# Altium project DIOT_temperature_logger.PrjPCB (part 3 of 6)

## Sheet EEM_DIOT_connector.SchDoc: Stabilizer
size 420 x 297 mm; Author: G.Kasprowicz; CompanyName: WUT ISE; DrawnBy: G.Kasprowicz; Organization: WUT ISE; Address1: PW ISE; Address2: Nowowiejska 15/19 00-665 Warsaw; Address3: gkasprow@gmail.com; DocumentNumber: 6; Revision: 1.0; SheetNumber: 6; SheetTotal: 8; ModifiedBy: -; CheckedDate: -; Title2: EEM connector & drivers; DivGrp: WUT ISE; Designer: G.Kasprowicz; ModifiedDate: -; ProjectName: Sensor Box
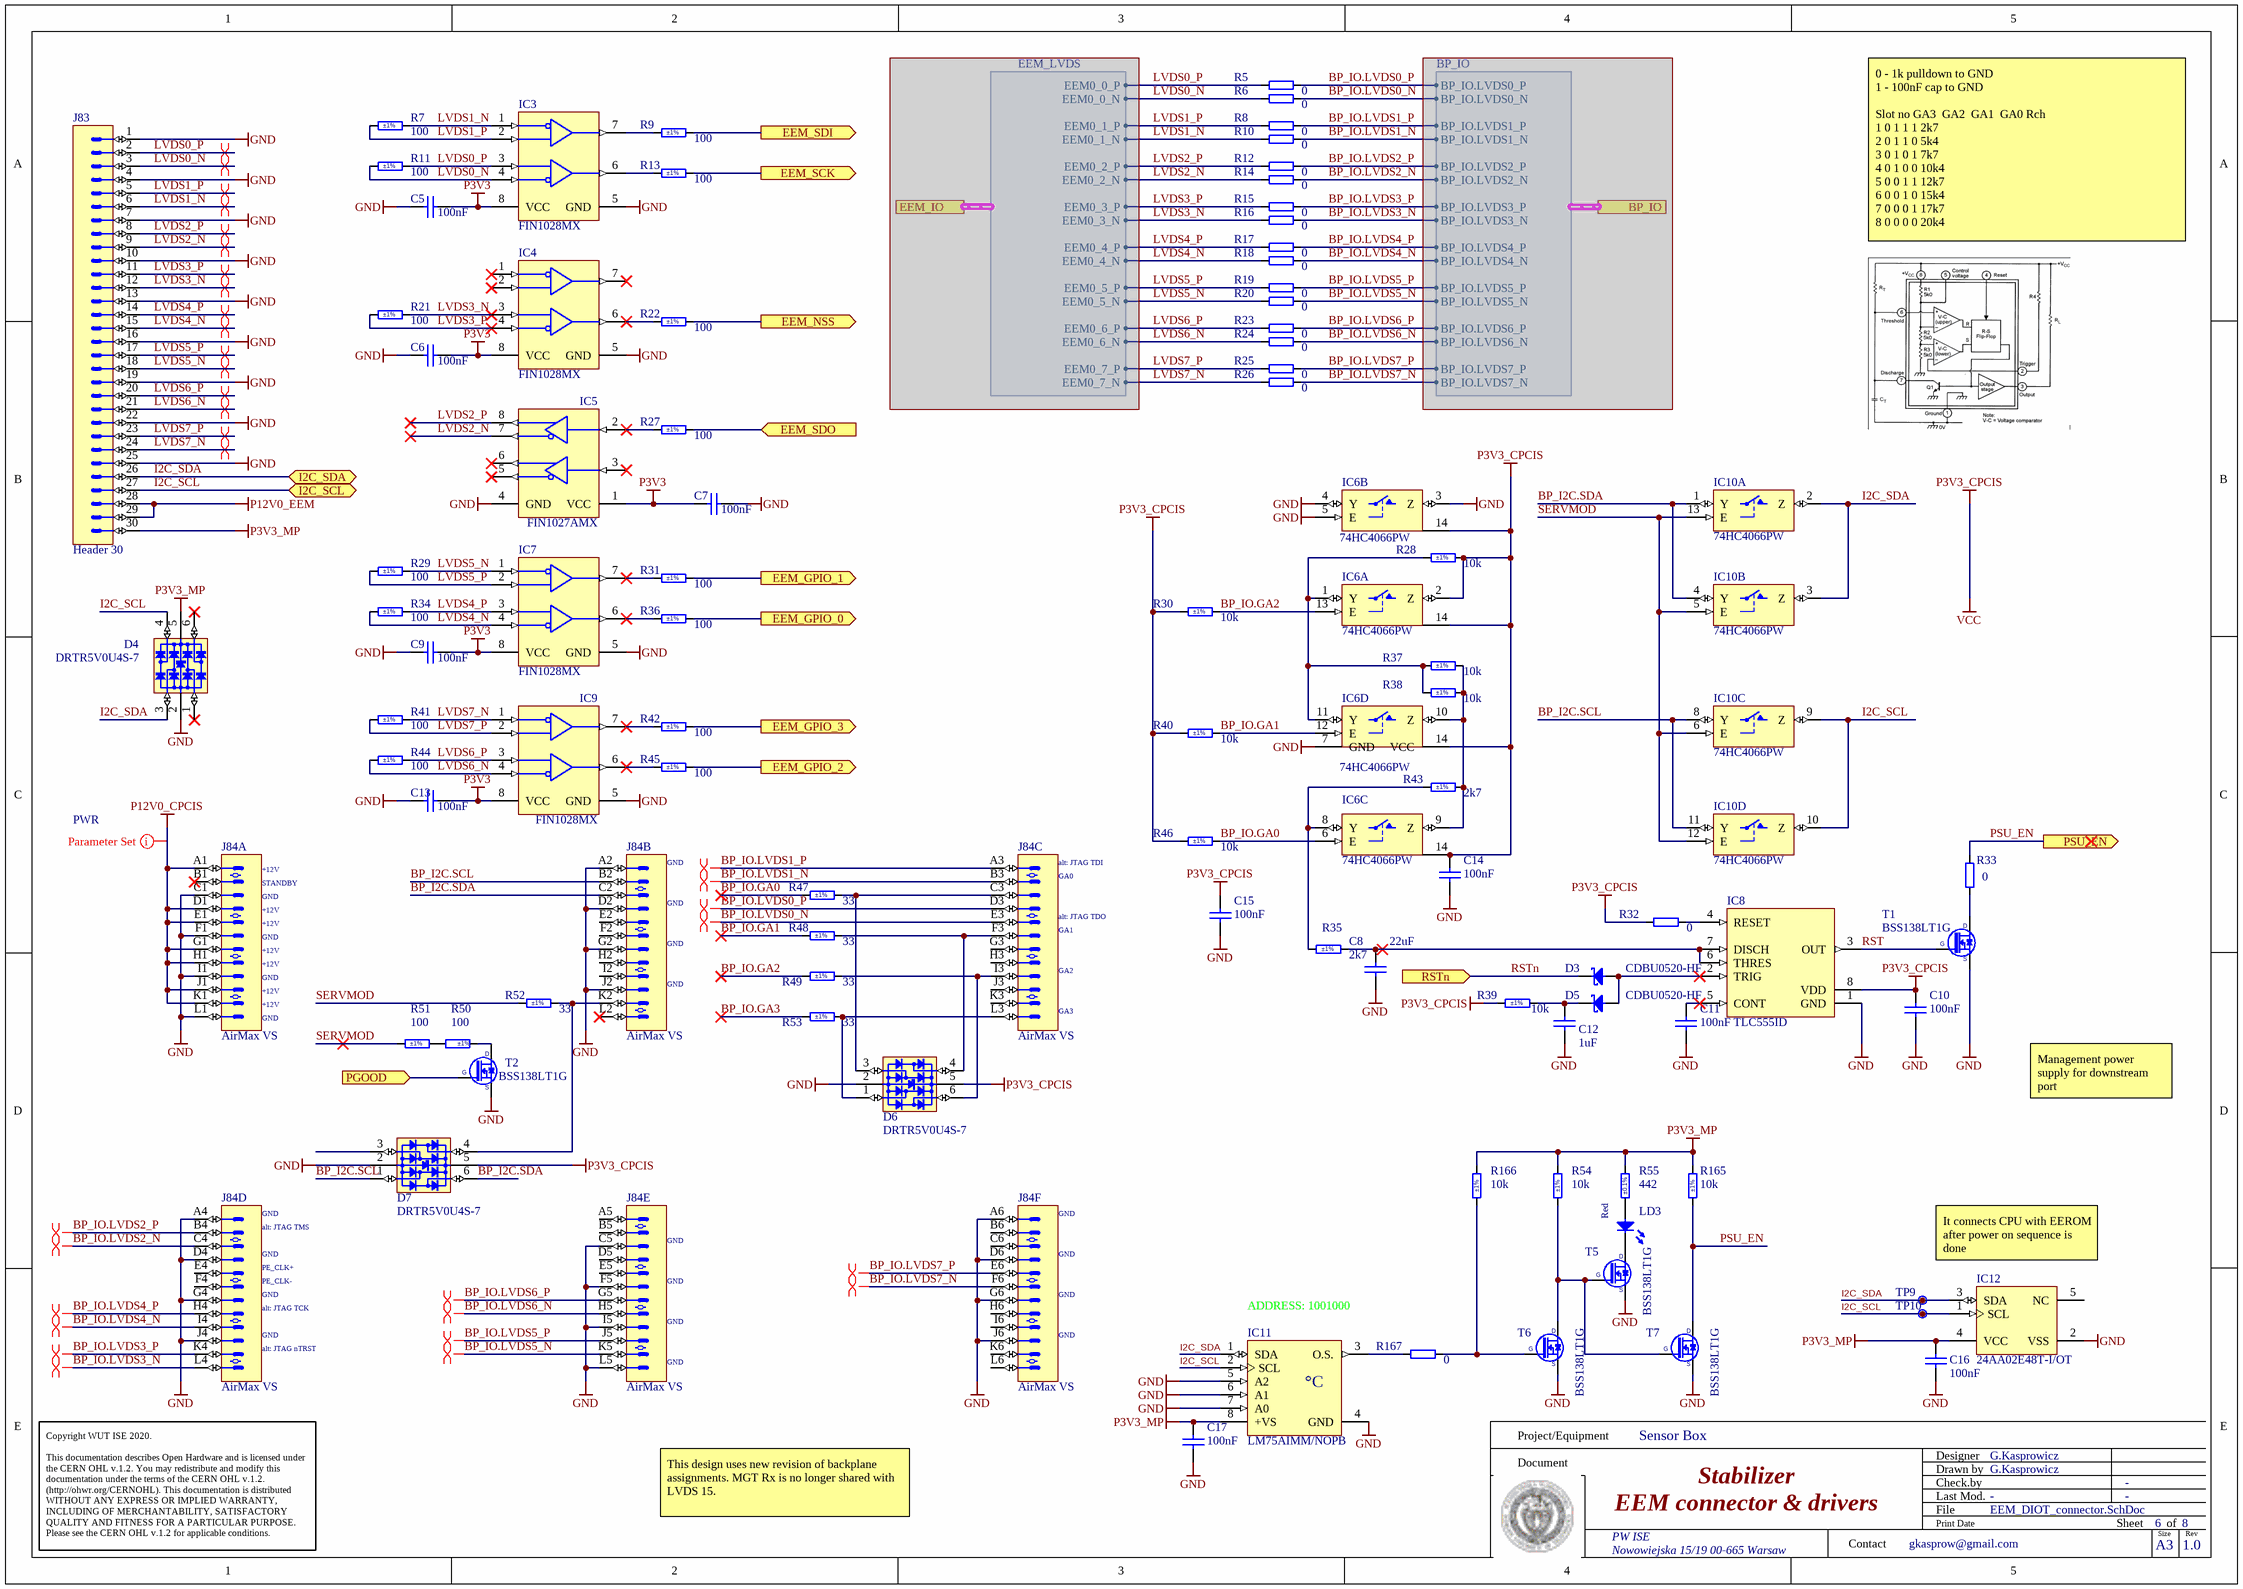
[diagram p3: EEM_DIOT_connector.SchDoc]

### Parts
C5  100nF  [CAPC1608X87N]
C6  100nF  [CAPC1608X87N]
C7  100nF  [CAPC1608X87N]
C8  22uF  [CAPC2012X135N]
C9  100nF  [CAPC1608X87N]
C10  100nF  [CAPC1608X87N]
C11  100nF  [CAPC1608X87N]
C12  1uF  [CAPC1608X87N]
C13  100nF  [CAPC1608X87N]
C14  100nF  [CAPC1608X87N]
C15  100nF  [CAPC1608X87N]
C16  100nF  [CAPC1608X87N]
C17  100nF  [CAPC1608X87N]
D3  CDBU0520-HF  [SOD-523F]
D4  DRTR5V0U4S-7  [SOT65P210X110-6N]
D5  CDBU0520-HF  [SOD-523F]
D6  DRTR5V0U4S-7  [SOT65P210X110-6N]
D7  DRTR5V0U4S-7  [SOT65P210X110-6N]
IC3  FIN1028MX  [SOIC127P600X175-8N]
IC4  FIN1028MX  [SOIC127P600X175-8N]
IC5  FIN1027AMX  [SOIC127P600X175-8N]
IC6  74HC4066PW  [SOP65P640X110-14N]  (parts A,B,C,D of 4)
IC7  FIN1028MX  [SOIC127P600X175-8N]
IC8  TLC555ID  [SOIC127P600X175-8N]
IC9  FIN1028MX  [SOIC127P600X175-8N]
IC10  74HC4066PW  [SOP65P640X110-14N]  (parts A,B,C,D of 4)
IC11  LM75AIMM/NOPB  [SOP65P490X109-8N]
IC12  24AA02E48T-I/OT  [SOT95P280X145-5N]
J83  Header 30  [3M_N2530-6002RB]
J84  AirMax VS  [AMPHENOL_10052825-101LF]  (parts A,B,C,D,E,F of 6)
LD3  Red  [LED_KINGBRIGHT_KPH-1608SURCK]
R5  0  [RESC1608X55N]
R6  0  [RESC1608X55N]
R7  100  Tolerance: ±1%  [RESC1608X55N]
R8  0  [RESC1608X55N]
R9  100  Tolerance: ±1%  [RESC1608X55N]
R10  0  [RESC1608X55N]
R11  100  Tolerance: ±1%  [RESC1608X55N]
R12  0  [RESC1608X55N]
R13  100  Tolerance: ±1%  [RESC1608X55N]
R14  0  [RESC1608X55N]
R15  0  [RESC1608X55N]
R16  0  [RESC1608X55N]
R17  0  [RESC1608X55N]
R18  0  [RESC1608X55N]
R19  0  [RESC1608X55N]
R20  0  [RESC1608X55N]
R21  100  Tolerance: ±1%  [RESC1608X55N]
R22  100  Tolerance: ±1%  [RESC1608X55N]
R23  0  [RESC1608X55N]
R24  0  [RESC1608X55N]
R25  0  [RESC1608X55N]
R26  0  [RESC1608X55N]
R27  100  Tolerance: ±1%  [RESC1608X55N]
R28  10k  Tolerance: ±1%  [RESC1608X55N]
R29  100  Tolerance: ±1%  [RESC1608X55N]
R30  10k  Tolerance: ±1%  [RESC1608X55N]
R31  100  Tolerance: ±1%  [RESC1608X55N]
R32  0  [RESC1608X55N]
R33  0  [RESC1608X55N]
R34  100  Tolerance: ±1%  [RESC1608X55N]
R35  2k7  Tolerance: ±1%  [RESC1608X55N]
R36  100  Tolerance: ±1%  [RESC1608X55N]
R37  10k  Tolerance: ±1%  [RESC1608X55N]
R38  10k  Tolerance: ±1%  [RESC1608X55N]
R39  10k  Tolerance: ±1%  [RESC1608X55N]
R40  10k  Tolerance: ±1%  [RESC1608X55N]
R41  100  Tolerance: ±1%  [RESC1608X55N]
R42  100  Tolerance: ±1%  [RESC1608X55N]
R43  2k7  Tolerance: ±1%  [RESC1608X55N]
R44  100  Tolerance: ±1%  [RESC1608X55N]
R45  100  Tolerance: ±1%  [RESC1608X55N]
R46  10k  Tolerance: ±1%  [RESC1608X55N]
R47  33  Tolerance: ±1%  [RESC1608X55N]
R48  33  Tolerance: ±1%  [RESC1608X55N]
R49  33  Tolerance: ±1%  [RESC1608X55N]
R50  100  Tolerance: ±1%  [RESC1608X55N]
R51  100  Tolerance: ±1%  [RESC1608X55N]
R52  33  Tolerance: ±1%  [RESC1608X55N]
R53  33  Tolerance: ±1%  [RESC1608X55N]
R54  10k  Tolerance: ±1%  [RESC1608X55N]
R55  442  Tolerance: ±0.1%  [RESC1608X55N]
R165  10k  Tolerance: ±1%  [RESC1608X55N]
R166  10k  Tolerance: ±1%  [RESC1608X55N]
R167  0  [RESC1608X55N]
T1  BSS138LT1G  [SOT95P240X110-3N]
T2  BSS138LT1G  [SOT95P240X110-3N]
T5  BSS138LT1G  [SOT95P240X110-3N]
T6  BSS138LT1G  [SOT95P240X110-3N]
T7  BSS138LT1G  [SOT95P240X110-3N]
TP9  Test Point  [TPS127]  (value not drawn)  (net tie, no BOM)
TP10  Test Point  [TPS127]  (value not drawn)  (no BOM)

### Ports
BP_IO (harness BP_IO), EEM_GPIO_0 (out), EEM_GPIO_1 (out), EEM_GPIO_2 (out), EEM_GPIO_3 (out), EEM_IO (harness EEM_LVDS), EEM_NSS (out), EEM_SCK (out), EEM_SDI (out), EEM_SDO (in), I2C_SCL (bidir), I2C_SDA (bidir), PGOOD (in), PSU_EN (out), RSTn (in)

### Harnesses
EEM_LVDS: EEM0_0_P, EEM0_0_N, EEM0_1_P, EEM0_1_N, EEM0_2_P, EEM0_2_N, EEM0_3_P, EEM0_3_N, EEM0_4_P, EEM0_4_N, EEM0_5_P, EEM0_5_N, EEM0_6_P, EEM0_6_N, EEM0_7_P, EEM0_7_N
BP_IO: BP_IO.LVDS0_P, BP_IO.LVDS0_N, BP_IO.LVDS1_P, BP_IO.LVDS1_N, BP_IO.LVDS2_P, BP_IO.LVDS2_N, BP_IO.LVDS3_P, BP_IO.LVDS3_N, BP_IO.LVDS4_P, BP_IO.LVDS4_N, BP_IO.LVDS5_P, BP_IO.LVDS5_N, BP_IO.LVDS6_P, BP_IO.LVDS6_N, BP_IO.LVDS7_P, BP_IO.LVDS7_N

### Nets
GND: C5.2 C6.2 C7.1 C8.1 C9.2 C10.1 C11.1 C12.1 C13.2 C14.1 C15.1 C16.1 C17.1 D4.2(GND) D6.2(GND) D7.2(GND) IC3.5(GND) IC4.5(GND) IC5.4(GND) IC6.3(Z) IC6.4(Y) IC6.5(E) IC6.7(GND) IC7.5(GND) IC8.1(GND) IC9.5(GND) IC10.7(GND) IC11.4(GND) IC11.5(A2) IC11.6(A1) IC11.7(A0) IC12.2(VSS) J83.1 J83.4 J83.7 J83.10 J83.13 J83.16 J83.19 J83.22 J83.25 J84.A2 J84.A4 J84.A6 J84.C1 J84.C5 J84.D2 J84.D4 J84.D6 J84.F1 J84.F5 J84.G2 J84.G4 J84.G6 J84.I1 J84.I5 J84.J2 J84.J4 J84.J6 J84.L1 J84.L5 T1.2(S) T2.2(S) T5.2(S) T6.2(S) T7.2(S)
P3V3: C5.1 C6.1 C7.2 C9.1 C13.1 IC3.8(VCC) IC4.8(VCC) IC5.1(VCC) IC7.8(VCC) IC9.8(VCC)
P3V3_CPCIS: C10.2 C14.2 C15.2 D6.5(VBUS) D7.5(VBUS) IC6.2(Z) IC6.14(VCC) IC8.8(VDD) IC10.14(VCC) R28.2 R30.1 R32.1 R39.1 R40.1 R46.1  [also labelled VCC]
P3V3_MP: C16.2 C17.2 D4.5(VBUS) IC11.8(+VS) IC12.4(VCC) J83.30 R54.1 R55.2 R165.1 R166.1
P12V0_CPCIS: J84.A1 J84.D1 J84.E1 J84.G1 J84.H1 J84.J1 J84.K1
P12V0_EEM: J83.28 J83.29
BP_I2C.SCL: D7.1(I/O1) IC10.8(Y) IC10.11(Y) J84.B2
BP_I2C.SDA: D7.6(I/O4) IC10.1(Y) IC10.4(Y) J84.C2
BP_IO.GA0: IC6.6(E) R46.2 R47.2
BP_IO.GA1: IC6.12(E) R40.2 R48.2
BP_IO.GA2: IC6.13(E) R30.2 R49.2
BP_IO.GA3: R53.2
BP_IO.LVDS0_N: J84.E3 R6.1
BP_IO.LVDS0_P: J84.D3 R5.1
BP_IO.LVDS1_N: J84.B3 R10.1
BP_IO.LVDS1_P: J84.A3 R8.1
BP_IO.LVDS2_N: J84.C4 R14.1
BP_IO.LVDS2_P: J84.B4 R12.1
BP_IO.LVDS3_N: J84.L4 R16.1
BP_IO.LVDS3_P: J84.K4 R15.1
BP_IO.LVDS4_N: J84.I4 R18.1
BP_IO.LVDS4_P: J84.H4 R17.1
BP_IO.LVDS5_N: J84.K5 R20.1
BP_IO.LVDS5_P: J84.J5 R19.1
BP_IO.LVDS6_N: J84.H5 R24.1
BP_IO.LVDS6_P: J84.G5 R23.1
BP_IO.LVDS7_N: J84.F6 R26.1
BP_IO.LVDS7_P: J84.E6 R25.1
CSN: R22.1 ; port EEM_NSS
EEM_GPIO_0: R36.1 ; port EEM_GPIO_0
EEM_GPIO_1: R31.1 ; port EEM_GPIO_1
EEM_GPIO_2: R45.1 ; port EEM_GPIO_2
EEM_GPIO_3: R42.1 ; port EEM_GPIO_3
EEM_SCK: R13.1 ; port EEM_SCK
EEM_SDI: R9.1 ; port EEM_SDI
EEM_SDO: R27.1 ; port EEM_SDO
I2C_SCL: D4.4(I/O3) IC10.9(Z) IC10.10(Z) IC11.2(SCL) IC12.1(SCL) J83.27 TP10.1 ; port I2C_SCL
I2C_SDA: D4.3(I/O2) IC10.2(Z) IC10.3(Z) IC11.1(SDA) IC12.3(SDA) J83.26 TP9.1 ; port I2C_SDA
LVDS0_N: IC3.4(RIN2-) J83.3 R6.2 R11.2
LVDS0_P: IC3.3(RIN2+) J83.2 R5.2 R11.1
LVDS1_N: IC3.1(RIN1-) J83.6 R7.1 R10.2
LVDS1_P: IC3.2(RIN1+) J83.5 R7.2 R8.2
LVDS2_N: IC5.7(DOUT-) J83.9 R14.2
LVDS2_P: IC5.8(DOUT+) J83.8 R12.2
LVDS3_N: IC4.3(RIN2+) J83.12 R16.2 R21.1
LVDS3_P: IC4.4(RIN2-) J83.11 R15.2 R21.2
LVDS4_N: IC7.4(RIN2-) J83.15 R18.2 R34.2
LVDS4_P: IC7.3(RIN2+) J83.14 R17.2 R34.1
LVDS5_N: IC7.1(RIN1-) J83.18 R20.2 R29.1
LVDS5_P: IC7.2(RIN1+) J83.17 R19.2 R29.2
LVDS6_N: IC9.4(RIN2-) J83.21 R24.2 R44.2
LVDS6_P: IC9.3(RIN2+) J83.20 R23.2 R44.1
LVDS7_N: IC9.1(RIN1-) J83.24 R26.2 R41.1
LVDS7_P: IC9.2(RIN1+) J83.23 R25.2 R41.2
PGOOD: T2.1(G) ; port PGOOD
PSU_EN: R33.2 R165.2 T7.3(D) ; port PSU_EN
RST: IC8.3(OUT) T1.1(G)
RSTn: D3.1(C) ; port RSTn
SERVMOD: IC10.5(E) IC10.6(E) IC10.12(E) IC10.13(E) R51.2 R52.2
NetC8_2: C8.2 IC8.6(THRES) IC8.7(DISCH) R35.2
NetC11_2: C11.2 IC8.5(CONT)
NetC12_2: C12.2 D5.1(C) R39.2
NetD3_2: D3.2(A) D5.2(A) IC8.2(TRIG)
NetD6_1: D6.1(I/O1) J84.L3 R53.1
NetD6_3: D6.3(I/O2) J84.C3 R47.1
NetD6_4: D6.4(I/O3) J84.F3 R48.1
NetD6_6: D6.6(I/O4) J84.I3 R49.1
NetD7_4: D7.4(I/O3) J84.K2 R52.1
NetIC3_6: IC3.6(ROUT2) R13.2
NetIC3_7: IC3.7(ROUT1) R9.2
NetIC4_6: IC4.6(ROUT2) R22.2
NetIC5_2: IC5.2(DIN1) R27.2
NetIC6_1: IC6.1(Y) IC6.11(Y) R28.1 R37.1 R38.1
NetIC6_8: IC6.8(Y) R35.1 R43.1
NetIC6_9: IC6.9(Z) IC6.10(Z) R37.2 R38.2 R43.2
NetIC7_6: IC7.6(ROUT2) R36.2
NetIC7_7: IC7.7(ROUT1) R31.2
NetIC8_4: IC8.4(RESET) R32.2
NetIC9_6: IC9.6(ROUT2) R45.2
NetIC9_7: IC9.7(ROUT1) R42.2
NetIC11_3: IC11.3(O.S.) R167.1
NetLD3_1: LD3.1(C) T5.3(D)
NetLD3_2: LD3.2(A) R55.1
NetR33_1: R33.1 T1.3(D)
NetR50_1: R50.1 T2.3(D)
NetR50_2: R50.2 R51.1
NetR54_2: R54.2 T5.1(G) T6.3(D) T7.1(G)
NetR166_2: R166.2 R167.2 T6.1(G)

Not connected (* = marked no-connect by the designer): D4 1(I/O1)* 6(I/O4)*; D7 3(I/O2); IC4 1(RIN1-)* 2(RIN1+)* 7(ROUT1)*; IC5 3(DIN2RIN-)* 5(DOUT-)* 6(DOUT+)*; IC12 5(NC); J84 A5 B1* B5 B6 C6 D5 E2 E4 E5 F2 F4 G3 H2 H3 H6 I2 I6 J3 K3 K6 L2* L6

### Layout directives
differential pair: BP_IO.LVDS0_N, BP_IO.LVDS0_P, BP_IO.LVDS1_N, BP_IO.LVDS1_P, BP_IO.LVDS2_N, BP_IO.LVDS2_P, BP_IO.LVDS3_N, BP_IO.LVDS3_P, BP_IO.LVDS4_N, BP_IO.LVDS4_P, BP_IO.LVDS5_N, BP_IO.LVDS5_P, BP_IO.LVDS6_N, BP_IO.LVDS6_P, BP_IO.LVDS7_N, BP_IO.LVDS7_P, LVDS0_N, LVDS0_P, LVDS1_N, LVDS1_P, LVDS2_N, LVDS2_P, LVDS3_N, LVDS3_P, LVDS4_N, LVDS4_P, LVDS5_N, LVDS5_P, LVDS6_N, LVDS6_P, LVDS7_N, LVDS7_P
net class PWR: P12V0_CPCIS

### Notes on the sheet
- 0 - 1k pulldown to GND
  1 - 100nF cap to GND
  Slot no	GA3 	GA2 	GA1 	GA0	Rch
  1	0	1	1	1	2k7
  2	0	1	1	0	5k4
  3	0	1	0	1	7k7
  4	0	1	0	0	10k4
  5	0	0	1	1	12k7
  6	0	0	1	0	15k4
  7	0	0	0	1	17k7
  8	0	0	0	0	20k4
- (near J84) GND
- (near J84) alt: JTAG TDI
- (near J84) +12V
- (near J84) STANDBY
- (near J84) alt: JTAG TDO
- (near J84) GA1
- (near J84) GA0
- (near J84) GA2
- (near J84) GA3
- Management power supply for downstream port
- (near J84) alt: JTAG TMS
- (near J84) PE_CLK+
- It connects CPU with EEROM after power on sequence is done
- (near J84) alt: JTAG TCK
- (near J84) PE_CLK-
- (near IC11) ADDRESS: 1001000
- (near J84) alt: JTAG nTRST
- This design uses new revision of backplane assignments. MGT Rx is no longer shared with LVDS 15.
- Project/Equipment
- Document
- Designer
- Drawn by
- Check.by
- Copyright WUT ISE 2020.
  This documentation describes Open Hardware and is licensed under the CERN OHL v.1.2. You may redistribute and modify this documentation under the terms of the CERN OHL v.1.2. (http://ohwr.org/CERNOHL). This documentation is distributed WITHOUT ANY EXPRESS OR IMPLIED WARRANTY, INCLUDING OF MERCHANTABILITY, SATISFACTORY QUALITY AND FITNESS FOR A PARTICULAR PURPOSE. Please see the CERN OHL v.1.2 for applicable conditions.
- Contact
- File
- Last Mod.
- Print Date
- Sheet
- Size
- A3
- of
- Rev
- (in symbol LM75AIMM/NOPB) °C

### Library data of the parts
C5-C7 C9-C11 C13-C17 = CC0603_100NF_50V_10%_X7R: as C70 on sheet Thermostat_16CH; Part Number: CC0603_100NF_50V_10%_X7R; Component Kind: Standard; Component Type: Standard; Pin Count: 2; Value: 100nF; Status: Preferred; Manufacturer Part Number: CC0603_100NF_50V_10%_X7R; Case: 0603; Mounted: Yes; Socket: No; SMD: Yes; Sense: No; Manufacturer1 Example: PHYCOMP; Manufacturer1 ComponentHeight: 0.87mm; HelpURL: \\cern.ch\dfs\Applications\Altium\Datasheets\CC0603_X7R_PHYCOMP.pdf; Author: CERN DEM JLC; CreateDate: 03.12.2007; LatestRevisionDate: 03.12.2007
C8 = CC0805_22UF_16V_10%_X5R: as C26 on sheet MCU_STM32F4; Part Number: CC0805_22UF_16V_10%_X5R; Component Kind: Standard; Component Type: Standard; Pin Count: 2; Value: 22uF; Status: Preferred; Manufacturer Part Number: CC0805_22UF_16V_10%_X5R; Case: 0805; Mounted: Yes; Socket: No; SMD: Yes; Sense: No; Manufacturer1 Example: TDK; Manufacturer1 ComponentHeight: 1.35mm; HelpURL: \\cern.ch\dfs\Applications\Altium\Datasheets\CC0805_X5R_TDK_C.pdf; Author: CERN DEM JLC; CreateDate: 25.10.2012; LatestRevisionDate: 25.10.2012
C12 = CC0603_1UF_16V_10%_X7R: as C28 on sheet MCU_STM32F4; Part Number: CC0603_1UF_16V_10%_X7R; Component Kind: Standard; Component Type: Standard; Pin Count: 2; Value: 1uF; Status: None; Manufacturer Part Number: CC0603_1UF_16V_10%_X7R; Case: 0603; Mounted: Yes; Socket: No; SMD: Yes; Sense: No; Manufacturer1 Example: YAGEO PHYCOMP; Manufacturer1 ComponentHeight: 0.9mm; HelpURL: \\cern.ch\dfs\Applications\Altium\Datasheets\CC0603_X7R_PHYCOMP.pdf; Author: CERN DEM JLC; CreateDate: 03.12.2007; LatestRevisionDate: 17.04.2015
D3 D5 = CDBU0520-HF: as D11 on sheet MCU_STM32F4; Part Number: CDBU0520-HF; Component Kind: Standard; Component Type: Standard; Device: CDBU0520-HF; PackageDescription: Small Outline Diode Flat Lead (SOD-523F), Body; 1.80mm L X 1mm W X 0.85mm H; Manufacturer Part Number: CDBU0520-HF; Pin Count: 2; Case: SOD-523F; Mounted: Yes; Socket: No; SMD: Yes; Sense: No; ComponentHeight: 1mm; HelpURL: \\cern.ch\dfs\Applications\Altium\Datasheets\CDBU0520-HF.pdf; Author: CERN DEM HF; CreateDate: 13.10.2023; LatestRevisionDate: 13.10.2023
D4 D6 D7 = D_TVS_DRTR5V0U4S-7: as D21 on sheet Thermostat_16CH; Part Number: DRTR5V0U4S-7; Component Kind: Standard; Component Type: Standard; Device: DRTR5V0U4S-7; PackageDescription: SOT363, SC70-6, 0.65mm Pitch; 6 Pin, 1.25mm W X 2.00mm L X 1.10mm H body, IPC Medium Density; Status: Active; Manufacturer Part Number: DRTR5V0U4S-7; Pin Count: 6; Case: SOT363; Mounted: Yes; Socket: No; SMD: Yes; Sense: No; ComponentHeight: 1.1mm; HelpURL: \\cern.ch\dfs\Applications\Altium\Datasheets\PRTR5V0U4Y.pdf; Author: GK; CreateDate: 24.01.2017; LatestRevisionDate: 14.09.2020
IC3 IC4 IC7 IC9 = IFC_FIN1028: 3.3V LVDS 2-Bit High-Speed Differential Reciever; Manufacturer: ON Semiconductor; PressFit: No; Bonding: No; Part Number: FIN1028MX; Component Kind: Standard; Component Type: Standard; Device: FIN1028MX; PackageDescription: SOIC 8, Pitch 1.27mm - Body 4x5mm, IPC Medium Density; Part Description: 3.3V LVDS 2-Bit High-Speed Differential Reciever; Manufacturer Part Number: FIN1028MX; Pin Count: 8; Case: SOIC8; Mounted: Yes; Socket: No; SMD: Yes; Sense: No; ComponentHeight: 0.8mm; Author: GK; HelpURL: \\cern.ch\dfs\Applications\Altium\Datasheets\FIN1101K8X.pdf; CreateDate: 08/11/2016; LatestRevisionDate: 08/11/2016
IC5 = IFC_FIN1027A: 3.3V LVDS, 2-Bit, High-Speed, Differential Driver; Manufacturer: ON Semiconductor; PressFit: No; Bonding: No; Part Number: FIN1027AMX; Component Kind: Standard; Component Type: Standard; Device: FIN1027AMX; PackageDescription: SOIC 8, Pitch 1.27mm - Body 4x5mm, IPC Medium Density; Part Description: 3.3V LVDS, 2-Bit, High-Speed, Differential Driver; Manufacturer Part Number: FIN1027AMX; Pin Count: 8; Case: SOIC8; Mounted: Yes; Socket: No; SMD: Yes; Sense: No; ComponentHeight: 0.8mm; Author: GK; HelpURL: \\cern.ch\dfs\Applications\Altium\Datasheets\FIN1101K8X.pdf; CreateDate: 08/11/2016; LatestRevisionDate: 08/11/2016
IC6 = 74HC4066PW: Part Description: Quad Single-Pole Single-Throw Analog Switch; Manufacturer: NXP SEMICONDUCTORS; PressFit: No; Bonding: No; Table: Standard Logic; Part Number: 74HC4066PW; Component Kind: Standard; Component Type: Standard; Device: 74HC4066PW; PackageDescription: SOP, 14-Leads, Body 4.4x5mm (max), Pitch 0.65mm, IPC Medium Density; Manufacturer Part Number: 74HC4066PW; Pin Count: 14; Case: TSSOP14; Mounted: Yes; Socket: No; SMD: Yes; ComponentHeight: 1.1mm; Author: CERN DEM JLC; HelpURL: \\cern.ch\dfs\Applications\Altium\Datasheets\74HC4066PW.pdf; CreateDate: 2014-11-19; LatestRevisionDate: 2014-11-19
IC8 = TLC555ID: LinCMOS Timer; Manufacturer: TEXAS INSTRUMENTS; PressFit: No; Bonding: No; Part Number: TLC555ID; Component Kind: Standard; Component Type: Standard; Device: TLC555ID; PackageDescription: SOIC 8, Pitch 1.27mm, Body 4x5mm, IPC Medium Density; Part Description: LinCMOS Timer; Manufacturer Part Number: TLC555ID; Pin Count: 8; Case: SOIC8; Mounted: Yes; Socket: No; SMD: Yes; Sense: No; ComponentHeight: 1.75mm; Author: CERN DEM JMW; HelpURL: \\cern.ch\dfs\Applications\Altium\Datasheets\TLC555ID.pdf; CreateDate: 23.08.2016; LatestRevisionDate: 23.08.2016
IC10 = 74HC4066PW: Part Description: Quad Single-Pole Single-Throw Analog Switch; Manufacturer: NXP SEMICONDUCTORS; PressFit: No; Bonding: No; Part Number: 74HC4066PW; Component Kind: Standard; Component Type: Standard; Device: 74HC4066PW; PackageDescription: SOP, 0.65mm Pitch; 14 Pin, 4.40mm W X 5.00mm L X 1.20mm H body, IPC Medium Density; Manufacturer Part Number: 74HC4066PW; Pin Count: 14; Case: TSSOP14; Mounted: Yes; Socket: No; SMD: Yes; Sense: No; ComponentHeight: 1.1mm; Author: CERN DEM JLC; HelpURL: \\cern.ch\dfs\Applications\Altium\Datasheets\74HC4066PW.pdf; CreateDate: 19.11.2014; LatestRevisionDate: 19.11.2014
IC11 = LM75AIMM/NOPB: Digital Temperature Sensor and Thermal Watchdog with Two-Wire Interface; Part Description: -25° to +100°C ±2°C Digital Temperature Sensor and Thermal Watchdog with Two-Wire Interface; Manufacturer: TEXAS INSTRUMENTS; PressFit: No; Bonding: No; Part Number: LM75AIMM/NOPB; Component Kind: Standard; Component Type: Standard; Device: LM75AIMM/NOPB; PackageDescription: SOP, 0.65mm Pitch; 8 Pin, 3.00mm W X 3.00mm L X 1.09mm H body, IPC Medium Density; Manufacturer Part Number: LM75AIMM; Pin Count: 8; Case: SSOP8; Mounted: Yes; Socket: No; SMD: Yes; Sense: No; ComponentHeight: 1.09mm; HelpURL: \\cern.ch\dfs\Applications\Altium\Datasheets\LM75AIMM-NOPB.pdf; Author: CERN DEM JLC; CreateDate: 15.10.2012; LatestRevisionDate: 01.06.2022
IC12 = 24AA02E48T-I/OT: 1.7V-5.5V, 2K I2C Serial EEPROM With EUI-48 Node Identity; Manufacturer: MICROCHIP TECHNOLOGY; PressFit: No; Bonding: No; Part Number: 24AA02E48T-I/OT; Component Kind: Standard; Component Type: Standard; Device: 24AA02E48T-I/OT; PackageDescription: SOT, 0.95mm pitch; 5 pin, 1.60mm W X 2.90mm L X 1.45mm H body, IPC Medium Density; Part Description: 1.7V-5.5V, 2K I2C Serial EEPROM with EUI-48 Node Identity; Manufacturer Part Number: 24AA02E48T-I/OT; Pin Count: 5; Case: SOT23-5; Mounted: Yes; Socket: No; SMD: Yes; Sense: No; ComponentHeight: 1.45mm; HelpURL: \\cern.ch\dfs\Applications\Altium\Datasheets\24AA02E48T-I-OT.pdf; Author: CERN DEM MR; CreateDate: 31.03.2016; LatestRevisionDate: 31.03.2016
J83 = 3M_N2530-6002RB: Connector 30 Male; Part Description: 30 Contacts, Straight .100'' x .100'' Low Profile Four-Wall Header, (Solder Tail 2.84mm), 2500 Series; Manufacturer: 3M; PressFit: No; Part Number: 3M_N2530-6002RB; Component Kind: Standard; Component Type: Standard; Pin Count: 30; Family: Header 30; Mounted: Yes; Socket: No; SMD: No; Sense: No; Status: None; Manufacturer Part Number: N2530-6002RB; ComponentHeight: 10.03mm; HelpURL: \\cern.ch\dfs\Applications\Altium\Datasheets\3M_N2530-6002RB.pdf; Author: CERN DEM JLC; CreateDate: 11.02.2009; LatestRevisionDate: 27.10.2022
J84 = AMPHENOL_10052825-101LF: 72 Contacts Header, 6 Columns, 4 Pairs per Column; Part Description: 72 Contacts, 2mm Pitch, 6 Columns, 4 Pairs per Column, 4 Walls, Right Angle Header; Part Number: AMPHENOL_10052825-101LF; Component Kind: Standard; Component Type: Standard; Pin Count: 72; Family: AirMax VS; Mounted: Yes; Socket: No; SMD: No; PressFit: Yes; Sense: No; Status: None; Manufacturer: AMPHENOL; Manufacturer Part Number: 10052825-101LF; ComponentHeight: 15.35mm; HelpURL: \\cern.ch\dfs\Applications\Altium\Datasheets\AMPHENOL_10052825-101LF.pdf; ComponentLink1URL: \\cern.ch\dfs\Applications\Altium\Datasheets\AMPHENOL_10052825-101LF_Application.pdf; ComponentLink1Description: Application; Author: CERN DEM MR; CreateDate: 19.02.2018; LatestRevisionDate: 19.02.2018
LD3 = LED_KINGBRIGHT_KPH-1608SURCK: LED Red 1C 2A; Part Description: SMD Hyper Red LED, Case 1.6mmX0.8mm(0603), 0.65mm Thickness; PressFit: No; Bonding: No; Part Number: LED_KINGBRIGHT_KPH-1608SURCK; Component Kind: Standard; Component Type: Standard; Color: Red; PackageDescription: SMT Hyper Red LED, Case 0603, Body L 1.6 x W 0.8mm H 0.65mm; Manufacturer: KINGBRIGHT; Manufacturer Part Number: KPH-1608SURCK; Pin Count: 2; Mounted: Yes; Socket: No; SMD: Yes; Sense: No; ComponentHeight: 0.65mm; HelpURL: \\cern.ch\dfs\Applications\Altium\Datasheets\LED_KINGBRIGHT_KPH-1608SURCK.pdf; Author: CERN DEM JLC; CreateDate: 03.07.2017; LatestRevisionDate: 03.07.2017; Case: 0603
R5 R6 R8 R10 R12 R14-R20 R23-R26 R32 R33 R167 = R0603_0R_JUMPER: as R120 on sheet Thermostat_16CH; Part Number: R0603_0R_JUMPER; Component Kind: Standard; Component Type: Standard; Pin Count: 2; Value: 0; Status: Preferred; Manufacturer Part Number: R0603_0R_JUMPER; Case: 0603; Mounted: Yes; Sense: No; Socket: No; SMD: Yes; Manufacturer1 Example: NIC COMPONENT; Manufacturer1 ComponentHeight: 0.55mm; HelpURL: \\cern.ch\dfs\Applications\Altium\Datasheets\R0603_NIC_NRC.pdf; Author: CERN DEM JLC; CreateDate: 03.12.2007; LatestRevisionDate: 13.03.2008
R7 R9 R11 R13 R21 R22 R27 R29 R31 R34 R36 R41 R42 R44 R45 R50 R51 = R0603_100R_1%_0.1W_100PPM: as R90 on sheet MCU_STM32F4; Part Number: R0603_100R_1%_0.1W_100PPM; Component Kind: Standard; Component Type: Standard; Pin Count: 2; Value: 100; Status: Preferred; Manufacturer Part Number: R0603_100R_1%_0.1W_100PPM; Case: 0603; Mounted: Yes; Sense: No; Socket: No; SMD: Yes; Manufacturer1 Example: NIC COMPONENT; Manufacturer1 ComponentHeight: 0.55mm; HelpURL: \\cern.ch\dfs\Applications\Altium\Datasheets\R0603_NIC_NRC.pdf; Author: CERN DEM JLC; CreateDate: 03.12.2007; LatestRevisionDate: 13.03.2008
R28 R30 R37-R40 R46 R54 R165 R166 = R0603_10K_1%_0.1W_100PPM: as R56 on sheet MCU_STM32F4; Part Number: R0603_10K_1%_0.1W_100PPM; Component Kind: Standard; Component Type: Standard; Pin Count: 2; Value: 10k; Status: Preferred; Manufacturer Part Number: R0603_10K_1%_0.1W_100PPM; Case: 0603; Mounted: Yes; Sense: No; Socket: No; SMD: Yes; Manufacturer1 Example: NIC COMPONENT; Manufacturer1 ComponentHeight: 0.55mm; HelpURL: \\cern.ch\dfs\Applications\Altium\Datasheets\R0603_NIC_NRC.pdf; Author: CERN DEM JLC; CreateDate: 03.12.2007; LatestRevisionDate: 13.03.2008
R35 R43 = R0603_2K7_1%_0.1W_100PPM: as R58 on sheet MCU_STM32F4; Part Number: R0603_2K7_1%_0.1W_100PPM; Component Kind: Standard; Component Type: Standard; Pin Count: 2; Value: 2k7; Status: Preferred; Manufacturer Part Number: R0603_2K7_1%_0.1W_100PPM; Case: 0603; Mounted: Yes; Sense: No; Socket: No; SMD: Yes; Manufacturer1 Example: YAGEO PHYCOMP; Manufacturer1 ComponentHeight: 0.55mm; HelpURL: \\cern.ch\dfs\Applications\Altium\Datasheets\R0603_PHYCOMP_RC0603.pdf; Author: CERN DEM JLC; CreateDate: 02.05.2011; LatestRevisionDate: 02.05.2011
R47-R49 R52 R53 = R0603_33R_1%_0.1W_100PPM: as R86 on sheet MCU_STM32F4; Part Number: R0603_33R_1%_0.1W_100PPM; Component Kind: Standard; Component Type: Standard; Pin Count: 2; Value: 33; Status: Preferred; Manufacturer Part Number: R0603_33R_1%_0.1W_100PPM; Case: 0603; Mounted: Yes; Sense: No; Socket: No; SMD: Yes; Manufacturer1 Example: NIC COMPONENT; Manufacturer1 ComponentHeight: 0.55mm; HelpURL: \\cern.ch\dfs\Applications\Altium\Datasheets\R0603_NIC_NRC.pdf; Author: CERN DEM JLC; CreateDate: 03.12.2007; LatestRevisionDate: 13.03.2008
R55 = R0603_442R_0.1%_0.063W_10PPM: Resistor - 0.1%; Part Description: Thin Film Chip Resistor; Manufacturer: GENERIC; Manufacturer1 Part Number: RN73C1J442RBTDF; Power: 0.063W; TC: ±10ppm; PressFit: No; Part Number: R0603_442R_0.1%_0.063W_10PPM; Component Kind: Standard; Component Type: Standard; Pin Count: 2; Value: 442; Status: Not Recommended; Manufacturer Part Number: R0603_442R_0.1%_0.063W_10PPM; Case: 0603; Mounted: Yes; Sense: No; Socket: No; SMD: Yes; Manufacturer1 Example: TYCO HOLSWORTHY; Manufacturer1 ComponentHeight: 0.5mm; HelpURL: \\cern.ch\dfs\Applications\Altium\Datasheets\R0603_Tyco_RN73.pdf; Author: CERN DEM JLC; CreateDate: 03.12.2007; LatestRevisionDate: 13.03.2008
T1 T2 T5-T7 = BSS138LT1G: N-CHANNEL MOSFET WITH DIODE; Part Description: 50V, 200mA N-Channel Enhancement Mode Field-Effect Transistor; Manufacturer: ON SEMICONDUCTOR; PressFit: No; Bonding: No; Part Number: BSS138LT1G; Component Kind: Standard; Component Type: Standard; Device: BSS138LT1G; PackageDescription: SOT23, 0.95mm Pitch; 3 Pin, 1.40mm W X 3.00mm L X 1.10mm H body, IPC Medium Density; Manufacturer Part Number: BSS138L; Pin Count: 3; Case: SOT23-3; Mounted: Yes; Socket: No; SMD: Yes; Sense: No; ComponentHeight: 1.11mm; HelpURL: \\cern.ch\dfs\Applications\Altium\Datasheets\BSS138LT1G.pdf; Author: CERN DEM JLC; CreateDate: 23.03.2009; LatestRevisionDate: 25.05.2022
TP9 TP10 = SMD_PAD_1.27X1.27MM: Part Description: 1.27mm x 1.27mm PCB Copper Area (SMD Test Point); Mounted: No; Part Number: SMD_PAD_1.27X1.27MM; Component Type: Standard (No BOM); Pin Count: 1; Family: Test Point; Socket: No; SMD: Yes; Sense: No; Status: None; ComponentHeight: 0mm; HelpURL: Undefined; Author: CERN DEM JLC; CreateDate: 12.01.2008; LatestRevisionDate: 12.01.2008; PackageDescription: 1.27mm x 1.27mm PCB Copper Area (SMD Test Point)